# Altium schematic sheet 47-SOURCES_AWG.SchDoc
size 594 x 420 mm
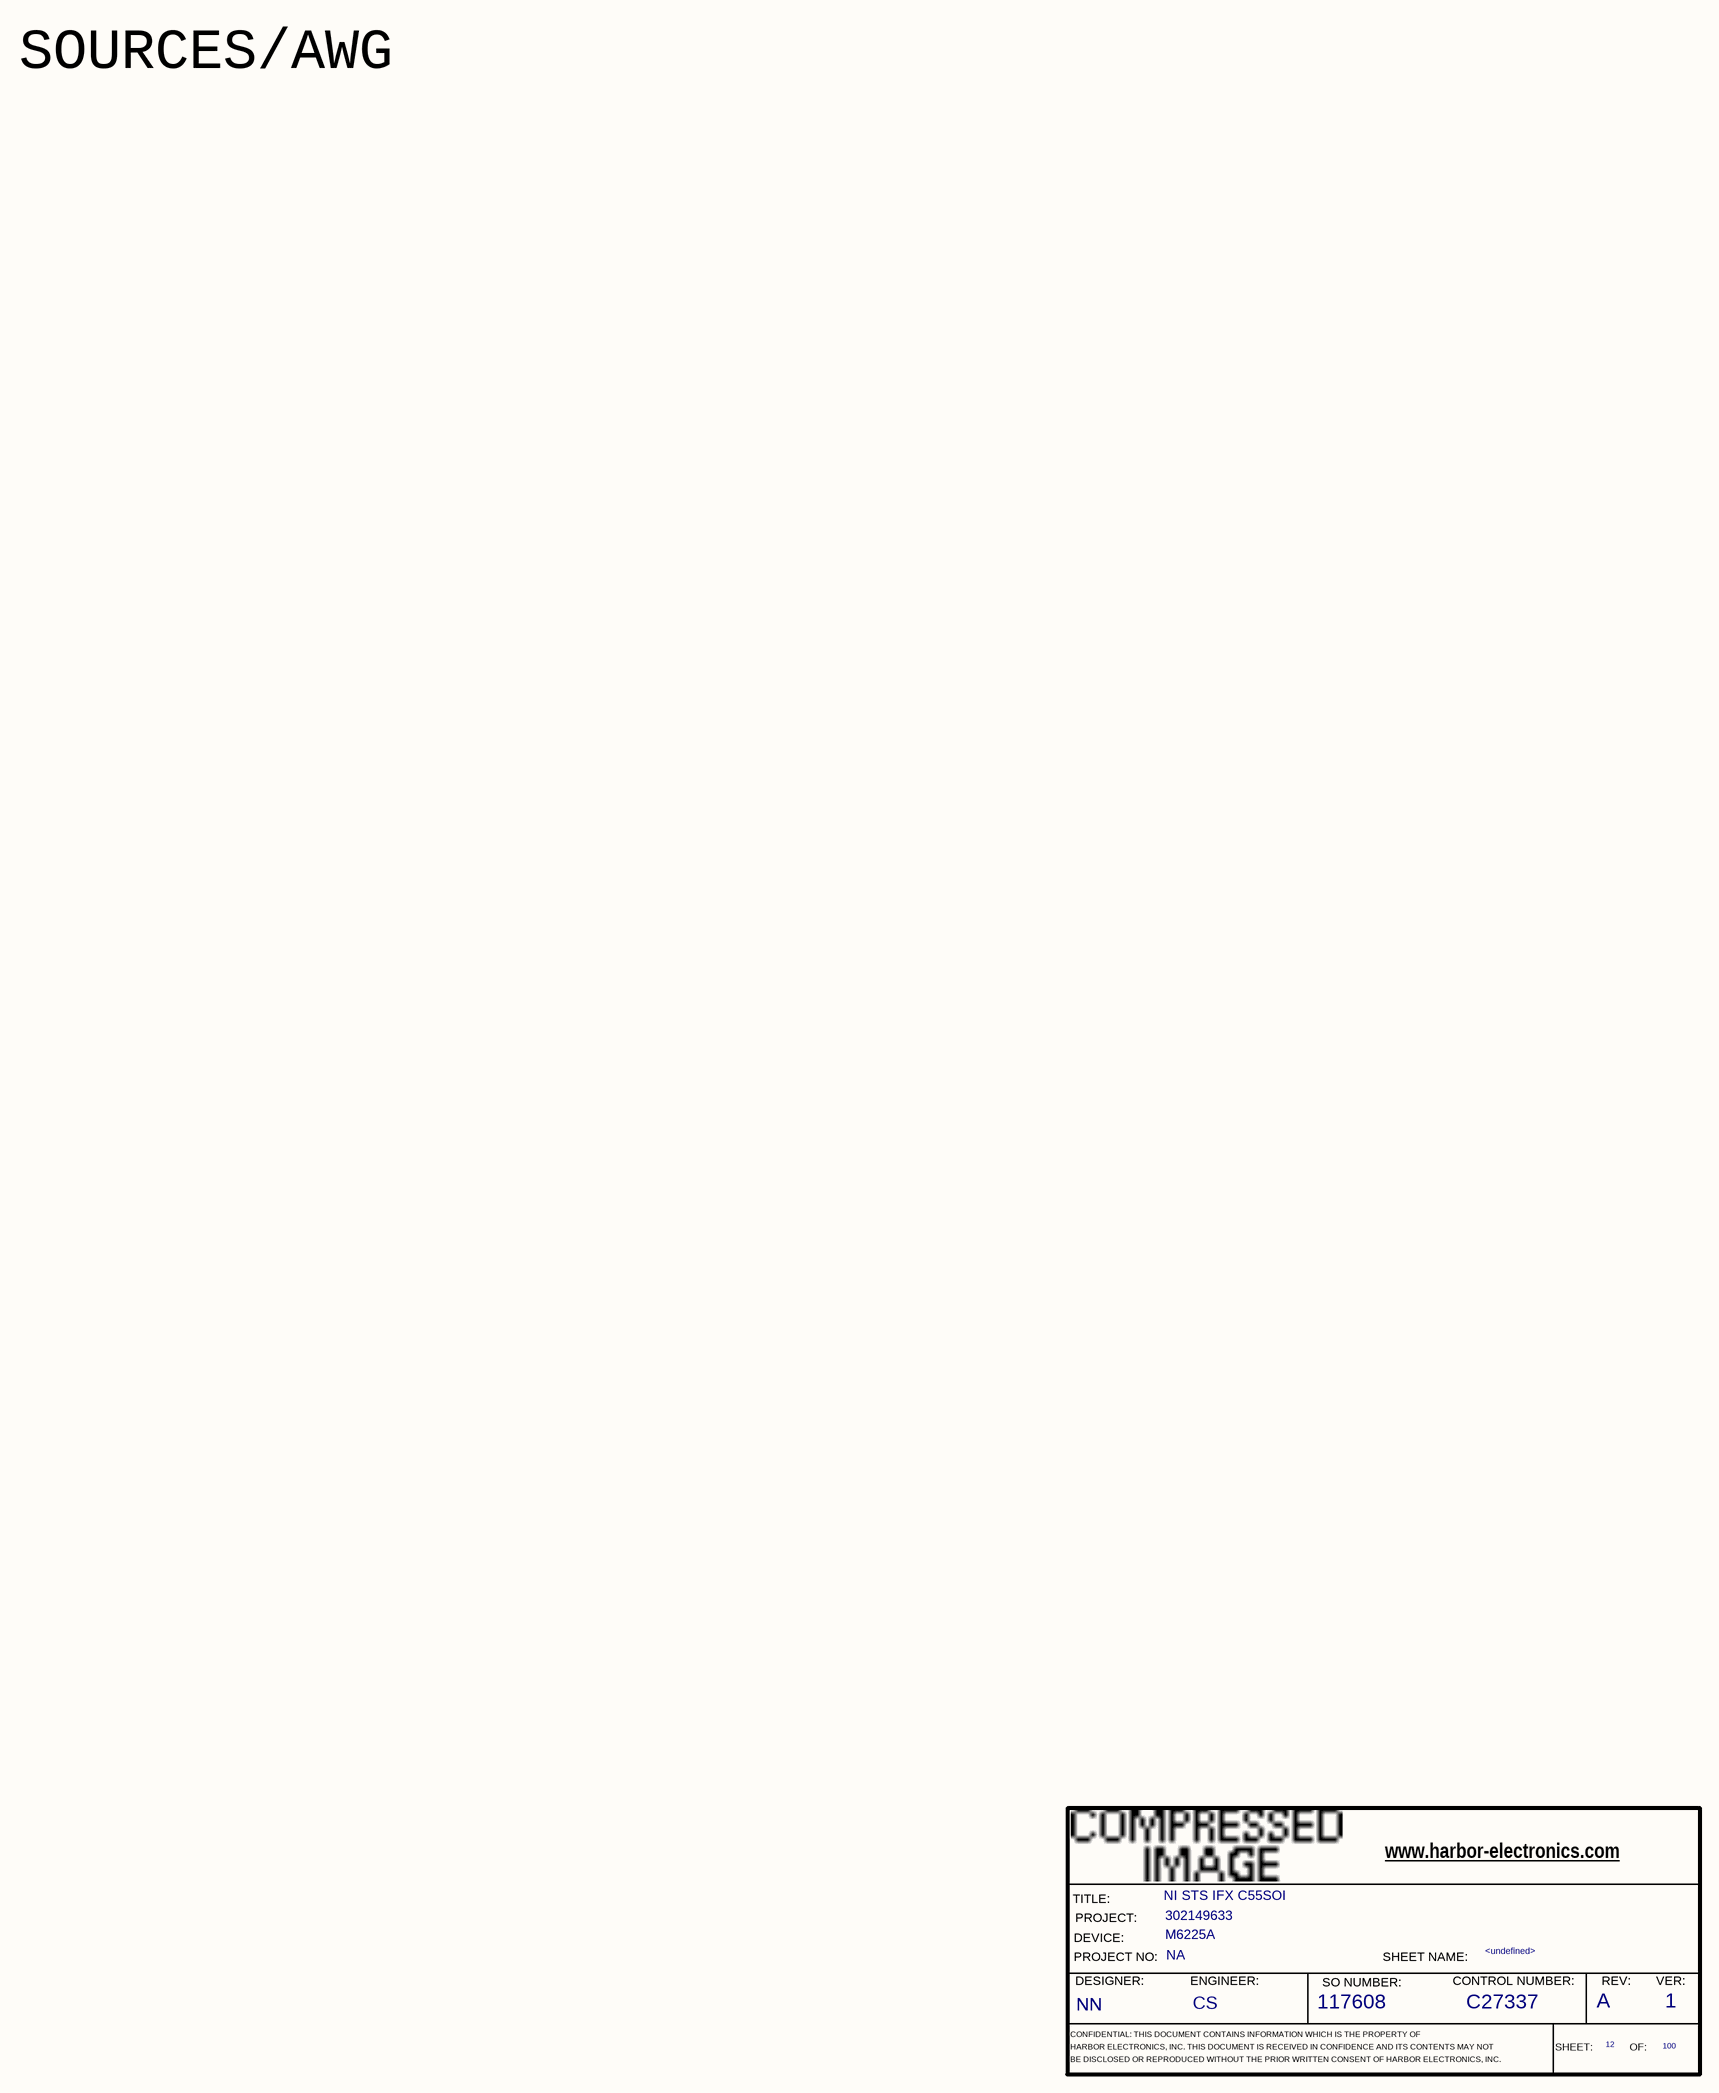
[diagram p0: 47-SOURCES_AWG.SchDoc]

## Parts
*  RevCode: A  Title: NI STS IFX C55SOI  Page Number: 12  Page Count: 100  Engineer: CS  Designer: NN  SO Number: 117608  Control Number: C27337  Version: 1  Page Name: <undefined>  PROJECT: 302149633  DEVICE: M6225A  PROJECT NO.: NA  (hidden comment: HE_DEFAULT)  (graphical)

## Notes on the sheet
- SOURCES/AWG
- (in symbol HE_DEFAULT) www.harbor-electronics.com; TITLE:; PROJECT:; DEVICE:; PROJECT NO:; SHEET NAME:; DESIGNER:; ENGINEER:; SO NUMBER:; CONTROL NUMBER:; REV:; VER:; CONFIDENTIAL: THIS DOCUMENT CONTAINS INFORMATION WHICH IS THE PROPERTY OF; HARBOR ELECTRONICS, INC. THIS DOCUMENT IS RECEIVED IN CONFIDENCE AND ITS CONTENTS MAY NOT; SHEET:; OF:; BE DISCLOSED OR REPRODUCED WITHOUT THE PRIOR WRITTEN CONSENT OF HARBOR ELECTRONICS, INC.

## Library data of the parts
* = HE_DEFAULT: Page Size: X; OrgAddr4: Fax: +1 602-431-9633; OrgAddr1: 4050 E. Cotton Center Blvd., Suite 33; OrgAddr2: Phoenix, Arizona 85040 U.S.A.; OrgAddr3: Phone: +1 602-438-1112; Doc: <Title Name>; OrgName: HARBOR